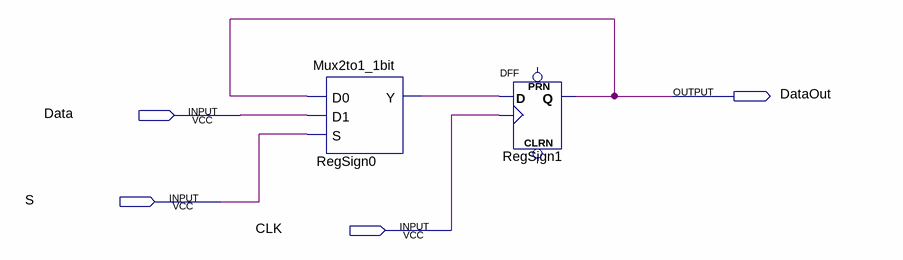
[diagram p0: schematic sheet]
// Quartus schematic RegSign.bdf as structural Verilog: 2 symbols, 4 pins
module RegSign (
  input  Data,
  input  S,
  input  CLK,
  output DataOut
);

  wire RegSign0_y;

  Mux2to1_1bit RegSign0 (.D0(DataOut), .D1(Data), .S(S), .Y(RegSign0_y));
  DFF RegSign1 (.CLK(CLK), .D(RegSign0_y), .Q(DataOut));  // open: CLRN, PRN
endmodule
